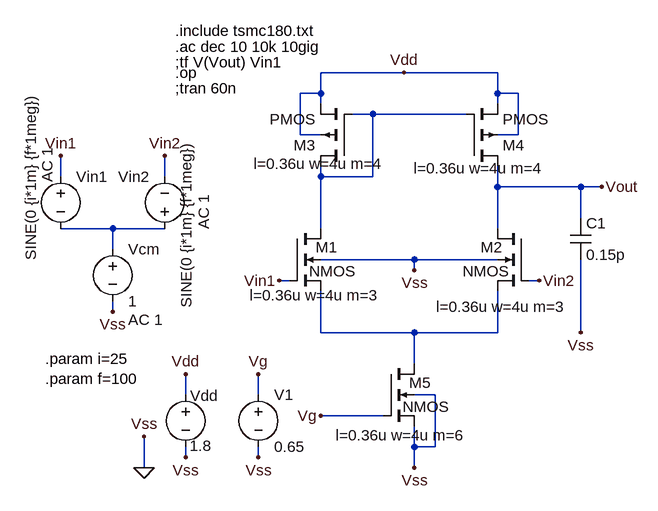
[diagram p0: schematic OP_AMP_22.asc]
OP_AMP_22.asc, the LTspice schematic file:
Version 4
SHEET 1 1528 680
WIRE 752 -64 624 -64
WIRE 896 -64 752 -64
WIRE 624 -32 624 -64
WIRE 624 -32 592 -32
WIRE 896 -32 896 -64
WIRE 928 -32 896 -32
WIRE 624 -16 624 -32
WIRE 896 -16 896 -32
WIRE 704 0 672 0
WIRE 848 0 704 0
WIRE 592 32 592 -32
WIRE 624 32 592 32
WIRE 928 32 928 -32
WIRE 928 32 896 32
WIRE 224 96 224 64
WIRE 384 96 384 64
WIRE 624 96 624 80
WIRE 704 96 704 0
WIRE 704 96 624 96
WIRE 896 112 896 80
WIRE 1024 112 896 112
WIRE 1056 112 1024 112
WIRE 1024 160 1024 112
WIRE 304 176 224 176
WIRE 384 176 304 176
WIRE 624 176 624 96
WIRE 896 176 896 112
WIRE 304 208 304 176
WIRE 768 224 624 224
WIRE 896 224 768 224
WIRE 768 240 768 224
WIRE 576 256 560 256
WIRE 960 256 944 256
WIRE 304 304 304 288
WIRE 624 336 624 272
WIRE 768 336 624 336
WIRE 896 336 896 272
WIRE 896 336 768 336
WIRE 1024 336 1024 224
WIRE 768 384 768 336
WIRE 416 432 416 400
WIRE 528 432 528 400
WIRE 800 432 768 432
WIRE 720 464 624 464
WIRE 768 512 768 480
WIRE 800 512 800 432
WIRE 800 512 768 512
WIRE 416 528 416 512
WIRE 528 528 528 512
WIRE 352 544 352 496
WIRE 768 544 768 512
FLAG 352 544 0
FLAG 352 496 Vss
FLAG 416 528 Vss
FLAG 304 304 Vss
FLAG 416 400 Vdd
FLAG 560 256 Vin1
FLAG 752 -64 Vdd
FLAG 960 256 Vin2
FLAG 768 240 Vss
FLAG 224 64 Vin1
FLAG 384 64 Vin2
FLAG 1024 336 Vss
FLAG 1056 112 Vout
FLAG 624 464 Vg
FLAG 528 400 Vg
FLAG 528 528 Vss
FLAG 768 544 Vss
SYMBOL nmos4 576 176 R0
WINDOW 0 40 29 Left 2
WINDOW 3 30 66 Left 2
WINDOW 123 139 103 Right 2
SYMATTR InstName M1
SYMATTR Value2 l=0.36u w=4u m=3
SYMBOL voltage 416 416 R0
WINDOW 123 0 0 Left 0
WINDOW 39 0 0 Left 0
WINDOW 0 7 17 Left 2
WINDOW 3 6 94 Left 2
SYMATTR InstName Vdd
SYMATTR Value 1.8
SYMBOL nmos4 944 176 M0
WINDOW 0 40 29 Left 2
WINDOW 3 30 66 Left 2
WINDOW 123 -58 120 Left 2
SYMATTR InstName M2
SYMATTR Value2 l=0.36u w=4u m=3
SYMBOL voltage 304 192 R0
WINDOW 123 24 124 Left 2
WINDOW 39 0 0 Left 0
SYMATTR Value2 AC 1
SYMATTR InstName Vcm
SYMATTR Value 1
SYMBOL voltage 224 80 R0
WINDOW 3 -46 -111 VRight 2
WINDOW 123 -21 -28 VRight 2
WINDOW 39 0 0 Left 0
SYMATTR Value SINE(0 {i*1m} {f*1meg})
SYMATTR Value2 AC 1
SYMATTR InstName Vin1
SYMBOL voltage 384 192 R180
WINDOW 0 24 96 Left 2
WINDOW 3 -33 -106 VRight 2
WINDOW 123 -60 15 VRight 2
WINDOW 39 0 0 Left 0
SYMATTR InstName Vin2
SYMATTR Value SINE(0 {i*1m} {f*1meg})
SYMATTR Value2 AC 1
SYMBOL pmos4 672 80 R180
WINDOW 123 -49 4 Left 2
SYMATTR Value2 l=0.36u w=4u m=4
SYMATTR InstName M3
SYMBOL pmos4 848 80 M180
WINDOW 123 -81 -3 Left 2
SYMATTR Value2 l=0.36u w=4u m=4
SYMATTR InstName M4
SYMBOL cap 1008 160 R0
SYMATTR InstName C1
SYMATTR Value 0.15p
SYMBOL nmos4 720 384 R0
WINDOW 0 40 29 Left 2
WINDOW 3 30 66 Left 2
WINDOW 123 127 110 Right 2
SYMATTR InstName M5
SYMATTR Value2 l=0.36u w=4u m=6
SYMBOL voltage 528 416 R0
WINDOW 123 0 0 Left 0
WINDOW 39 0 0 Left 0
SYMATTR InstName V1
SYMATTR Value 0.65
TEXT 400 -128 Left 2 !.include tsmc180.txt
TEXT 400 -64 Left 2 !.op
TEXT 400 -80 Left 2 !;tf V(Vout) Vin1
TEXT 400 -104 Left 2 !.ac dec 10 10k 10gig
TEXT 400 -40 Left 2 !;tran 60n
TEXT 200 376 Left 2 !.param i=25\n.param f=100

The netlist it stands for:
* OP_AMP_22.asc
M1 N001 Vin1 N003 0 NMOS l=0.36u w=4u m=3
Vdd Vdd 0 1.8
M2 Vout Vin2 N003 0 NMOS l=0.36u w=4u m=3
Vcm N002 0 1 AC 1
Vin1 Vin1 N002 SINE(0 {i*1m} {f*1meg}) AC 1
Vin2 N002 Vin2 SINE(0 {i*1m} {f*1meg}) AC 1
M3 N001 N001 Vdd Vdd PMOS l=0.36u w=4u m=4
M4 Vout N001 Vdd Vdd PMOS l=0.36u w=4u m=4
C1 Vout 0 0.15p
M5 N003 Vg 0 0 NMOS l=0.36u w=4u m=6
V1 Vg 0 0.65
.model NMOS NMOS
.model PMOS PMOS
.lib standard.mos
.include tsmc180.txt
.op
;tf V(Vout) Vin1
.ac dec 10 10k 10gig
;tran 60n
.param i=25
.param f=100
.backanno
.end